# Altium schematic sheet Fire_Warning.SchDoc
size A3; SheetNumber: 1; SheetTotal: 1
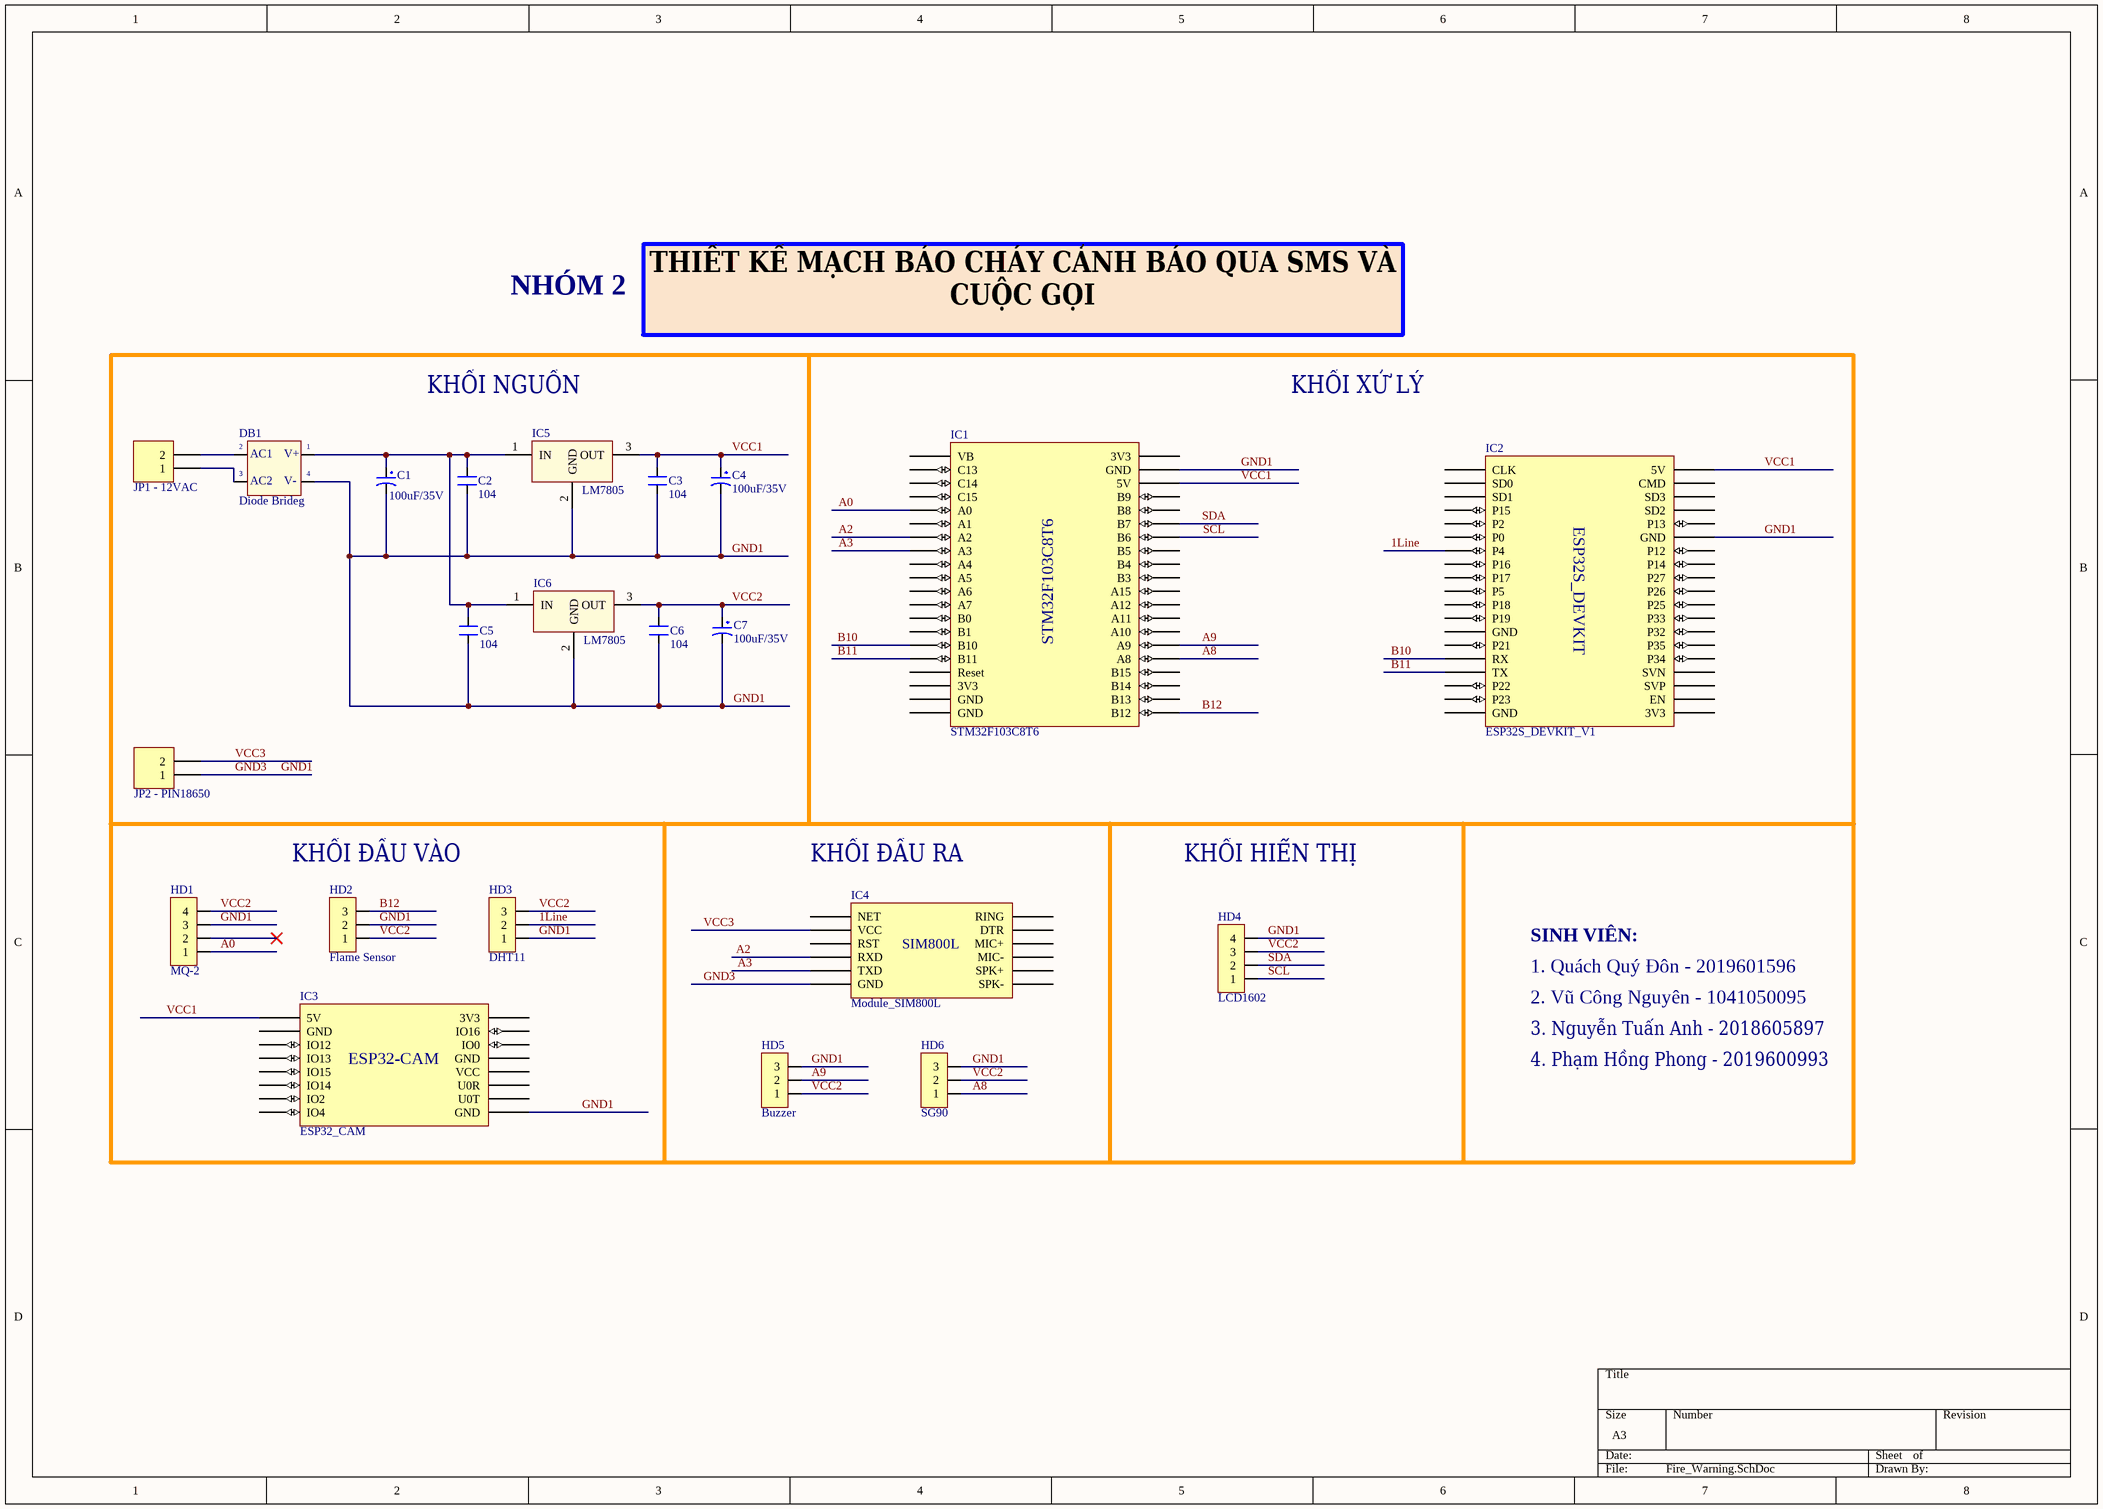
[diagram p0: Fire_Warning.SchDoc]

## Parts
C1  100uF/35V  [CP1.5/3.4]
C2  104  [CN2]
C3  104  [CN2]
C4  100uF/35V  [CP1.5/3.4]
C5  104  [CN2]
C6  104  [CN2]
C7  100uF/35V  [CP1.5/3.4]
DB1  Diode Brideg  [CAU 5A]
HD1  MQ-2  [HEADER 4]
HD2  Flame Sensor  [HEADER 3]
HD3  DHT11  [HEADER 3]
HD4  LCD1602  [HEADER 4]
HD5  Buzzer  [HEADER 3]
HD6  SG90  [HEADER 3]
IC1  STM32F103C8T6  [STM32F103C8T6]
IC2  ESP32S_DEVKIT_V1  [ESP32S_DEVKIT_V1]
IC3  ESP32_CAM  [ESP32_CAM]
IC4  Module_SIM800L  [Module Sim800L]
IC5  LM7805  [QTO-220]
IC6  LM7805  [QTO-220]
JP1_-_12VAC  Header 2_1  [HED2]  (value not drawn)
JP2_-_PIN18650  Header 2_1  [HED2]  (value not drawn)

## Nets
1Line: HD3.2 IC2.7(P4)
A0: HD1.1 IC1.24(A0)
A2: IC1.26(A2) IC4.4(RXD)
A3: IC1.27(A3) IC4.5(TXD)
A8: HD6.1 IC1.4(A8)
A9: HD5.2 IC1.5(A9)
B10: IC1.34(B10) IC2.15(RX)
B11: IC1.35(B11) IC2.16(TX)
B12: HD2.3 IC1.0(B12)
GND1: C1.2 C2.1 C3.1 C4.2 C5.1 C6.1 C7.2 DB1.4(-V_OUT) HD1.3 HD2.2 HD3.1 HD4.4 HD5.3 HD6.3 IC1.18(GND) IC2.33(GND) IC3.1(GND) IC4.6(GND) IC5.2(GND) IC6.2(GND) JP2_-_PIN18650.1  [also labelled GND3]
SCL: HD4.1 IC1.13(B6)
SDA: HD4.2 IC1.14(B7)
VCC1: C3.2 C4.1 IC1.17(5V) IC2.38(5V) IC3.9(5V) IC5.3(OUT)
VCC2: C6.2 C7.1 HD1.4 HD2.1 HD3.3 HD4.3 HD5.1 HD6.2 IC6.3(OUT)
VCC3: IC4.2(VCC) JP2_-_PIN18650.2
NetC1_1: C1.1 C2.2 C5.2 DB1.1(+V_OUT) IC5.1(IN) IC6.1(IN)
NetDB1_2: DB1.2(AC1) JP1_-_12VAC.2
NetDB1_3: DB1.3(AC2) JP1_-_12VAC.1

Not connected (* = marked no-connect by the designer): HD1 2*; IC1 1(B13) 2(B14) 3(B15) 6(A10) 7(A11) 8(A12) 9(A15) 10(B3) 11(B4) 12(B5) 15(B8) 16(B9) 19(3V3) 20(VB) 21(C13) 22(C14) 23(C15) 25(A1) 28(A4) 29(A5) 30(A6) 31(A7) 32(B0) 33(B1) 36(Reset) 37(3V3) 38(GND) 39(GND); IC2 1(CLK) 2(SD0) 3(SD1) 4(P15) 5(P2) 6(P0) 8(P16) 9(P17) 10(P5) 11(P18) 12(P19) 13(GND) 14(P21) 17(P22) 18(P23) 19(GND) 20(3V3) 21(EN) 22(SVP) 23(SVN) 24(P34) 25(P35) 26(P32) 27(P33) 28(P25) 29(P26) 30(P27) 31(P14) 32(P12) 34(P13) 35(SD2) 36(SD3) 37(CMD); IC3 2(U0T) 3(U0R) 4(VCC) 5(GND) 6(IO0) 7(IO16) 8(3V3) 10(GND) 11(IO12) 12(IO13) 13(IO15) 14(IO14) 15(IO2) 16(IO4); IC4 1(NET) 3(RST) 7(SPK-) 8(SPK+) 9(MIC-) 10(MIC+) 11(DTR) 12(RING)

## Notes on the sheet
- NHÓM 2
- THIẾT KẾ MẠCH BÁO CHÁY CẢNH BÁO QUA SMS VÀ CUỘC GỌI
- KHỐI NGUỒN
- KHỐI XỬ LÝ
- (near HD2) KHỐI ĐẦU VÀO
- (near IC4) KHỐI ĐẦU RA
- KHỐI HIỂN THỊ
- 1. Quách Quý Đôn - 2019601596
- SINH VIÊN:
- 2. Vũ Công Nguyên - 1041050095
- 3. Nguyễn Tuấn Anh - 2018605897
- 4. Phạm Hồng Phong - 2019600993
- (in symbol DB) V+; V-
- (in symbol ESP32_CAM) ESP32-CAM
- (in symbol ESP32S_DEVKIT_V1) ESP32S_DEVKIT
- (in symbol Module_SIM800L) SIM800L

## Library data of the parts
C1 C4 C7 = CP3: Cap 100uF/35V - 470uF/16V; Value: 100uF/35V/50V; Description 1: 1000uF/6,3V - 470uF/16V - 330uF - 25V; Description 2: 220uF/35V - 100uF/50V - 63V - 4,7uF/200V; Description 3: 22uF => 33uF100V - 3,3uF => 4,7uF/250V; Description 4: 2,2uF =>3,3uF/350 - 2,2uF/400V - 1uF/450V
C2 C3 C5 C6 = CN2: Cap np 104 => 105pF; Value: 0.1uF
DB1 = DB: Convert AC to DC voltage, 4 pin; Value: Cau 1A
HD1 HD4 = Header 4_MH: Header 4P XH2.54 thẳng
HD2 HD3 HD5 HD6 = Header 3_MH: Header 3P XH2.54 thẳng
IC5 IC6 = LM78xx: On ap +, from + 5 to + 24VDC; Value: LM7805
JP1_-_12VAC JP2_-_PIN18650 = Header 2_1: Header, 2-Pin; Manufacturer: Generic Components; Class: Connector; Value: Header 2